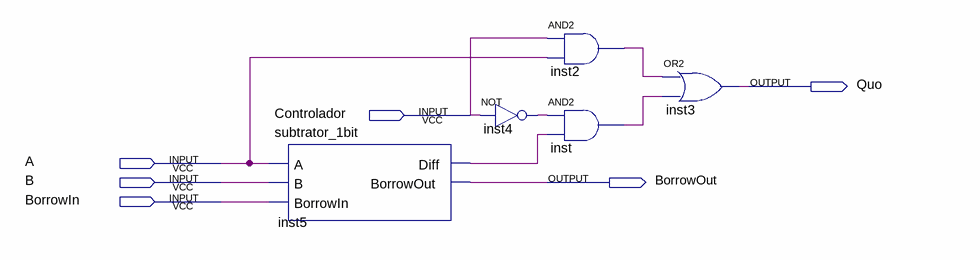
[diagram p0: schematic sheet]
// Quartus schematic divirsor1bit.bdf as structural Verilog: 5 symbols, 6 pins
module divirsor1bit (
  input  Controlador,
  input  A,
  input  B,
  input  BorrowIn,
  output Quo,
  output BorrowOut
);

  wire inst2_out, inst4_out, inst5_diff, inst_out;

  subtrator_1bit inst5 (.A(A), .B(B), .BorrowIn(BorrowIn), .Diff(inst5_diff), .BorrowOut(BorrowOut));
  not inst4 (inst4_out, Controlador);
  and inst2 (inst2_out, Controlador, A);
  and inst (inst_out, inst4_out, inst5_diff);
  or inst3 (Quo, inst2_out, inst_out);
endmodule
